# EAGLE design StickIt-RotaryEncoder (EAGLE 5.11)
AUTHOR: Dave Vandenbout / XESS Corp.; COPYRIGHT: 2013 XESS Corp.; VERSION#: 1.0
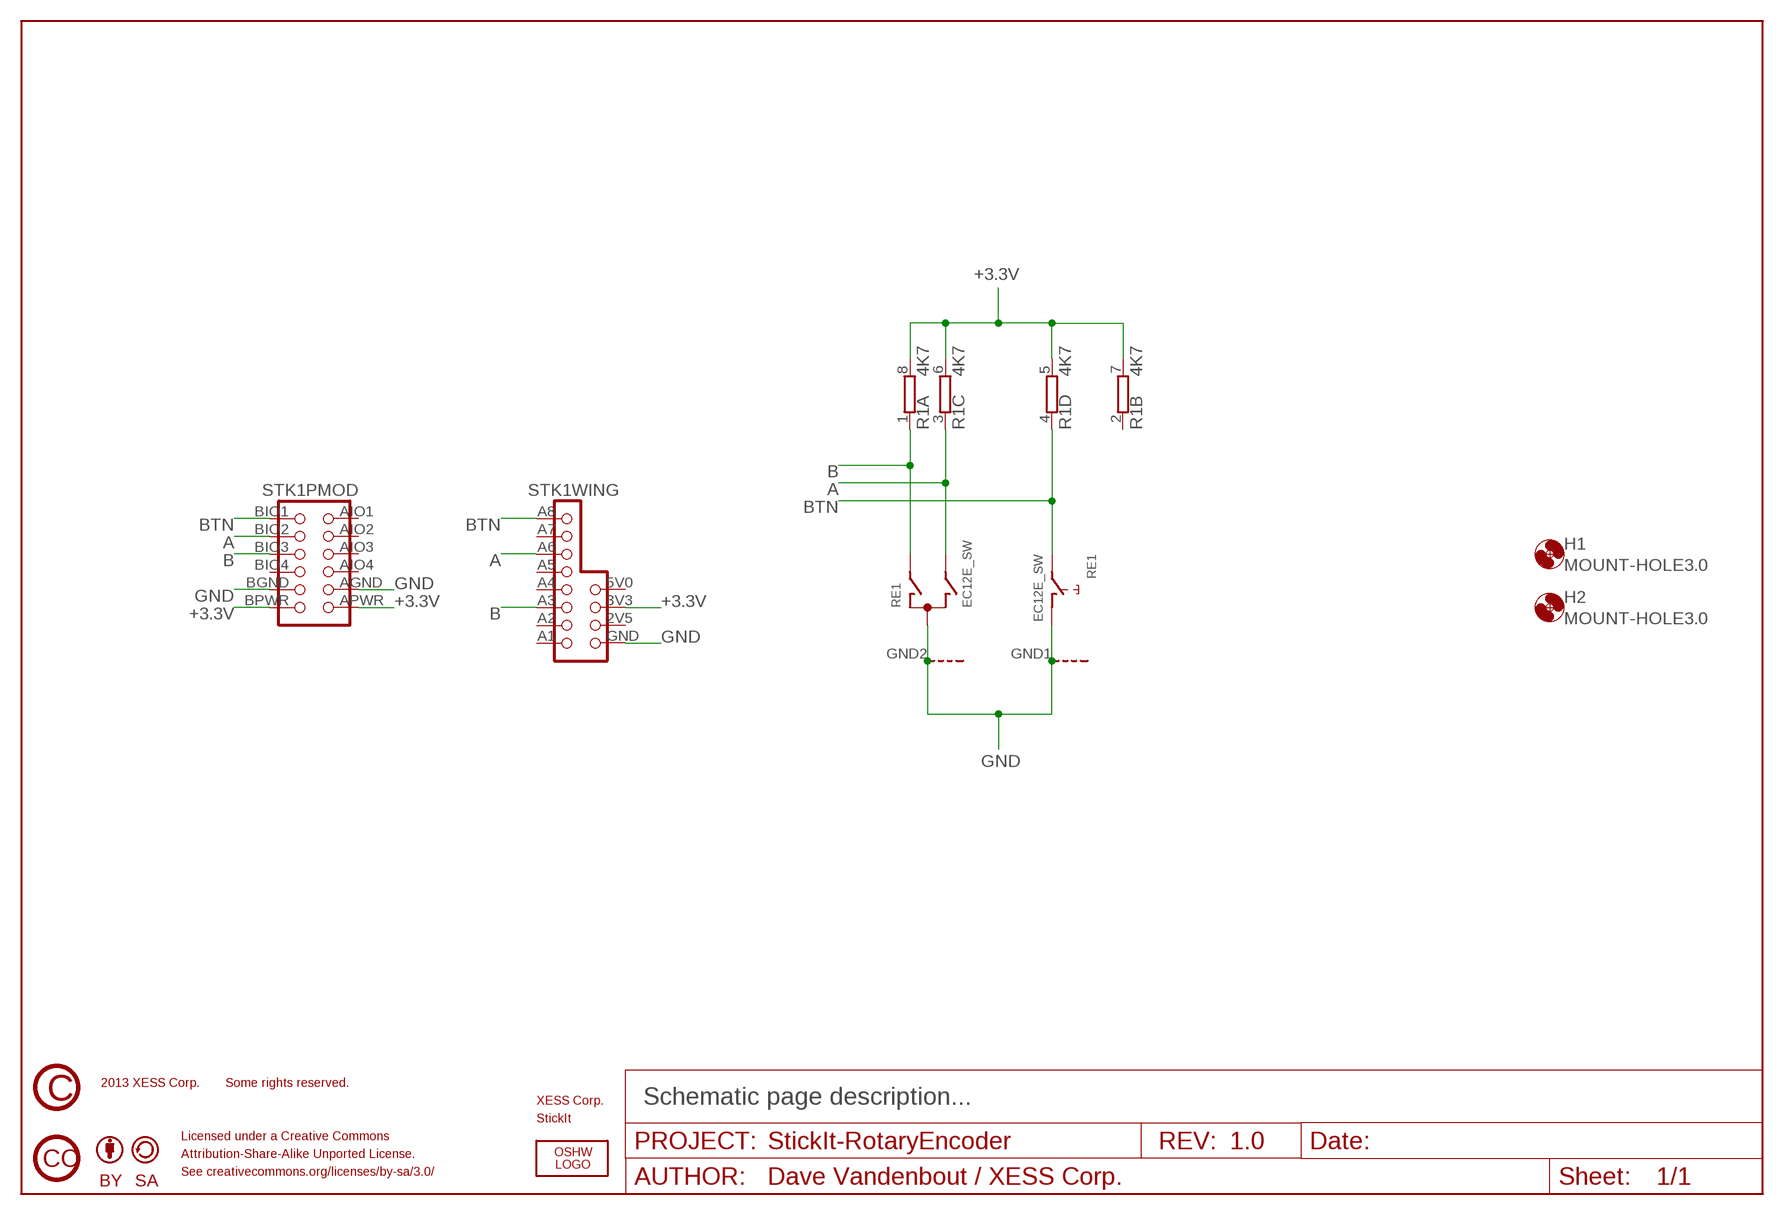
[diagram p0: schematic, sheet 1]

## Parts
H1  MOUNT-HOLE3.0  [3,0]
H2  MOUNT-HOLE3.0  [3,0]
LOGO1  OSHW_LOGO_FILLX0200-NT  [OSHW_FILLX200_NOTEXT]
R1  4K7  RES4742  [742C083]
RE1  EC12E_SW  [ALPS_EC12E_SW]
STK1  STICKIT-HEADER  STICKIT-HEADER1  [STICKIT-HEADER1]
U$1  LOGO-STICKIT700X200  [LOGO-STICKIT-700X200]
U$2  CC_CC  [CC_CC]
U$3  CC_BY  [CC_BY]
U$4  CC_SA  [CC_SA]
U$5  CC_COPYRIGHT  [CC_COPYRIGHT]
U$6  LOGO-XESS  LOGO-XESS700X120  [LOGO-XESS-700X120]

## Nets
+3.3V: R1.5 R1.6 R1.7 R1.8 STK1.3V3(WING:3V3) STK1.APWR(PMOD:APWR) STK1.BPWR(PMOD:BPWR)
A: R1.3 RE1.B STK1.A6(WING:A6) STK1.BIO2(PMOD:BIO2)
B: R1.1 RE1.A STK1.A3(WING:A3) STK1.BIO3(PMOD:BIO3)
BTN: R1.4 RE1.E STK1.A8(WING:A8) STK1.BIO1(PMOD:BIO1)
GND: RE1.C RE1.D RE1.GND1(G) RE1.GND2(G) STK1.AGND(PMOD:AGND) STK1.BGND(PMOD:BGND) STK1.GND(WING:GND)
Unconnected: R1.2 STK1.2V5(WING:2V5) STK1.5V0(WING:5V) STK1.A1(WING:A1) STK1.A2(WING:A2) STK1.A4(WING:A4) STK1.A5(WING:A5) STK1.A7(WING:A7) STK1.AIO1(PMOD:AIO1) STK1.AIO2(PMOD:AIO2) STK1.AIO3(PMOD:AIO3) STK1.AIO4(PMOD:AIO4) STK1.BIO4(PMOD:BIO4)

## Notes on the sheet
- Some rights reserved.
- Schematic page description...
- Licensed under a Creative Commons
- Attribution-Share-Alike Unported License.
- See creativecommons.org/licenses/by-sa/3.0/

## Library data of the parts
H1 H2 = holes:MOUNT-HOLE: MOUNTING HOLE with drill center marker
LOGO1 = oshw-logo:OSHW_LOGO_FILL
R1 = xess:RES4: Resistor 4-pack Package of four resistors.; DIGIKEY#: 742C083???JPCT-ND; MANF: CTS Resistor Products; MANF#: 742C083???JPTR; MOUSER#: 774-742C083???JP
RE1 = switch-alps:EC12E_SW: ALPS rotary Encoder EC12E series with switch; MPN: EC12E2424407; OC_FARNELL: 1520813; OC_NEWARK: 74M1068
STK1 = xess:STICKIT-HEADER: StickIt Header Combined PMOD and Papilio Wing header for use on StickIt add-on boards.
U$1 = xess:LOGO-STICKIT
U$2 = xess:CC_CC
U$3 = xess:CC_BY
U$4 = xess:CC_SA
U$5 = xess:CC_COPYRIGHT
U$6 = xess:LOGO-XESS

## Net classes
1 power: clearance 0.254 mm

## Board
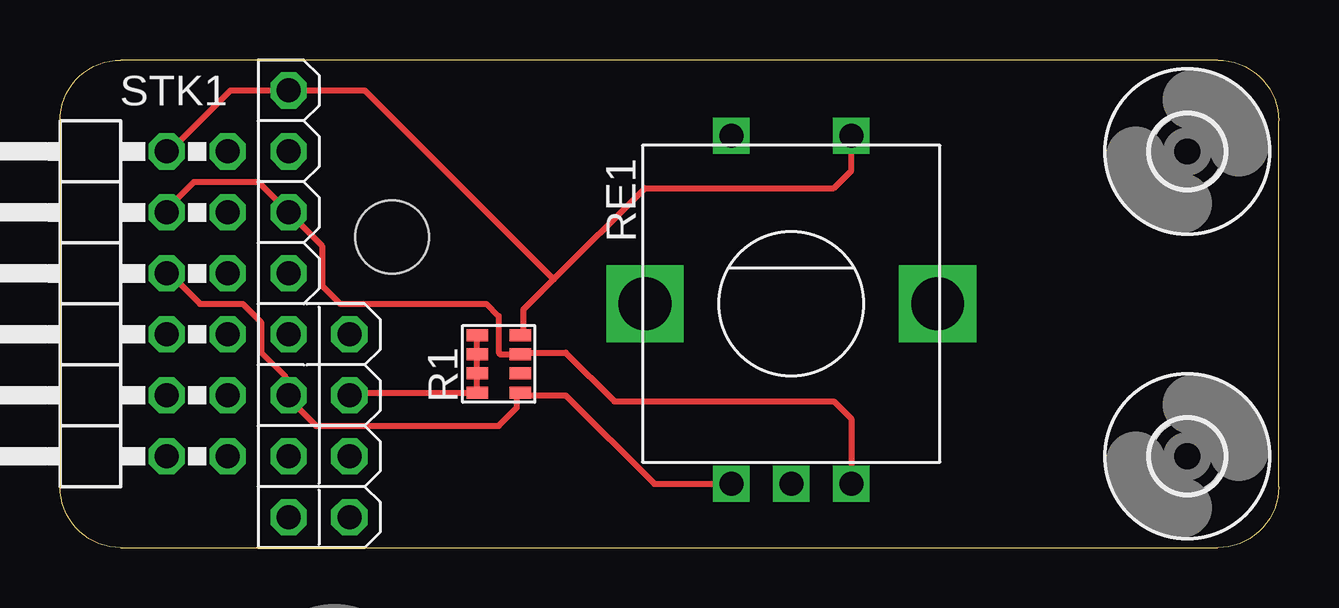
[diagram p1: board, top side]
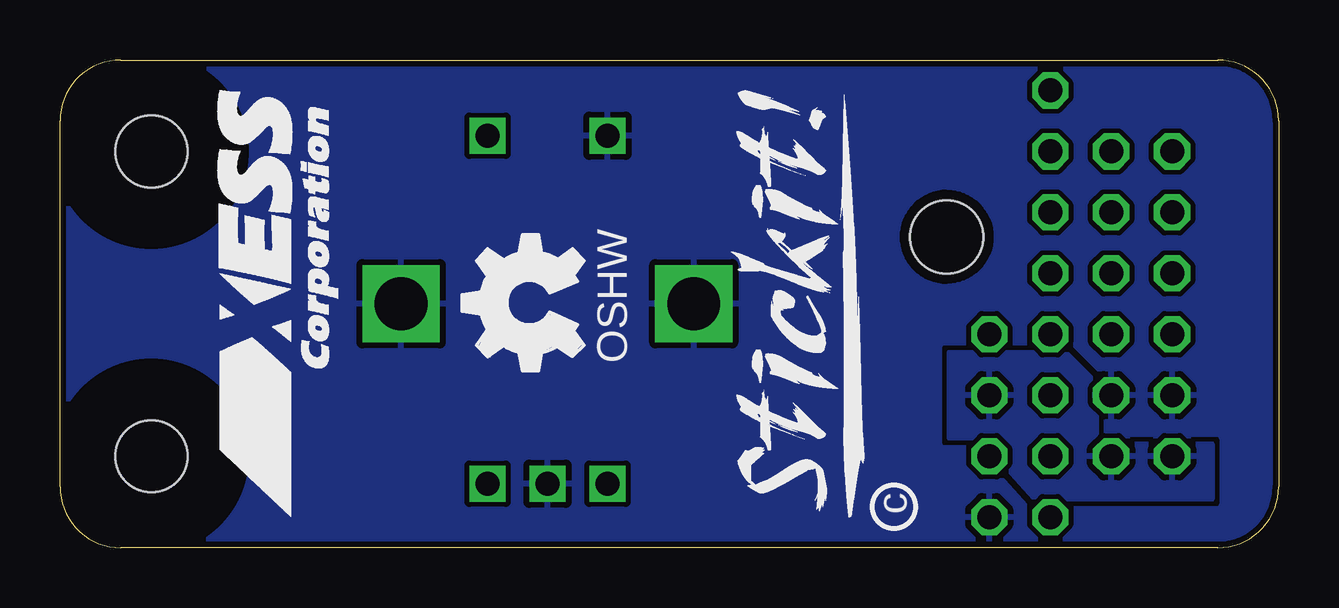
[diagram p2: board, bottom side, seen from below]

Size 50.8 x 20.32 mm. Coordinates in mm from the lower left corner, seen from the top.
Outline: 2.54,0 48.26,0 arc90 50.8,2.54 50.8,17.78 arc90 48.26,20.32 2.54,20.32 arc90 0,17.78 0,2.54 arc90 2.54,0
Copper layers (1*16): Top 0.035mm / dielectric 1.5mm / Bottom 0.035mm
Design rules "ITeadstudio_safe": minimum track width 8mil, minimum drill 12mil, track to track 8mil, track to pad 8mil, pad to pad 8mil, via to via 8mil, smd to smd 0mil, copper to edge 10mil, drill to drill 10mil, minimum pad ring 10mil, minimum via ring 8mil, stop-mask expansion 2mil, vias tented up to drill 100mil, thermal gap 10mil

### Footprints (pad centres in the part's own frame; a part is rotated, then mirrored left to right if it is on the bottom)
3,0 = hole 3: 0,0
742C083 = smd 0.5 x 0.9: 1 -0.4,-0.9; 2 0.4,-0.9; 3 1.2,-0.9; 4 2,-0.9; 5 2,0.9; 6 1.2,0.9; 7 0.4,0.9; 8 -0.4,0.9
ALPS_EC12E_SW = drill 1 square: A -2.5,-7.5; B 2.5,-7.5; C 0,-7.5; D -2.5,7; E 2.5,7 | drill 2.2 square: GND1 -6.1,0; GND2 6.1,0
STICKIT-HEADER1 = drill 1 octagon: 2V5 5.08,-15.24; 3V3 5.08,-12.7; 5V0 5.08,-10.16; A1 2.54,-17.78; A2 2.54,-15.24; A3 2.54,-12.7; A4 2.54,-10.16; A5 2.54,-7.62; A6 2.54,-5.08; A7 2.54,-2.54; A8 2.54,0; AGND 0,-12.7; AIO1 0,-2.54; AIO2 0,-5.08; AIO3 0,-7.62; AIO4 0,-10.16; APWR 0,-15.24; BGND -2.54,-12.7; BIO1 -2.54,-2.54; BIO2 -2.54,-5.08; BIO3 -2.54,-7.62; BIO4 -2.54,-10.16; BPWR -2.54,-15.24; GND 5.08,-17.78 | hole 3.048: 6.858,-6.096

### Placement (x,y rotation side)
H1  46.99,3.81 0 top
H2  46.99,16.51 0 top
LOGO1  28.96,7.37 90 bottom
R1  18.29,6.86 90 top
RE1  30.48,10.16 0 top
STK1  6.99,19.05 0 top
U$1  17.27,1.27 90 bottom
U$2  11.43,-14.61 0 top  (outside the outline)
U$3  18.41,-13.34 0 top  (outside the outline)
U$4  23.5,-13.34 0 top  (outside the outline)
U$5  11.43,-5.71 0 top  (outside the outline)
U$6  41.15,1.27 90 bottom

### Tracks (layer width: path | path; a pad name or v marks a point on that pad's centre or on a via)
+3.3V
  Top 0.254: STK1.3V3 12.17,6.46 R1.8 R1.7 R1.6 R1.5
  pour Bottom: 2.79,2.03 10.16,2.03 12.45,4.57 13.72,4.57 13.72,8.13 8.89,8.13 7.62,6.86 7.62,4.32 2.79,4.32
A
  Top 0.254: STK1.BIO2 4.45,14.1 5.59,15.24 8.26,15.24 STK1.A6 10.92,12.57 10.92,10.92 11.68,10.16 17.78,10.16 18.29,9.65 18.29,8.13 18.36,8.06 R1.3 19.26,8.13 21.08,8.13 23.11,6.1 32.26,6.1 32.98,5.37 RE1.B
B
  Top 0.254: STK1.BIO3 4.57,11.43 5.84,10.16 7.62,10.16 8.38,9.4 8.38,8.13 9.4,7.11 9.4,6.48 STK1.A3 9.53,6.22 10.67,5.08 18.29,5.08 19.05,5.84 19.05,6.32 R1.1 19.3,6.35 21.08,6.35 24.77,2.66 RE1.A
BTN
  Top 0.254: STK1.BIO1 4.57,16.51 7.11,19.05 STK1.A8 12.7,19.05 20.57,11.18 | RE1.E 32.98,15.71 32.26,14.99 24.38,14.99 20.57,11.18 | 20.57,11.18 19.3,9.91 19.3,8.97 R1.4
GND
  pour Bottom (rank 6): 0,0 0,20.32 50.8,20.32 50.8,0

### Text on the board
bPlace: OSHW | c
tDocu: Some rights reserved. | Licensed under a Creative Commons | Attribution-Share-Alike Unported License. | See creativecommons.org/licenses/by-sa/3.0/